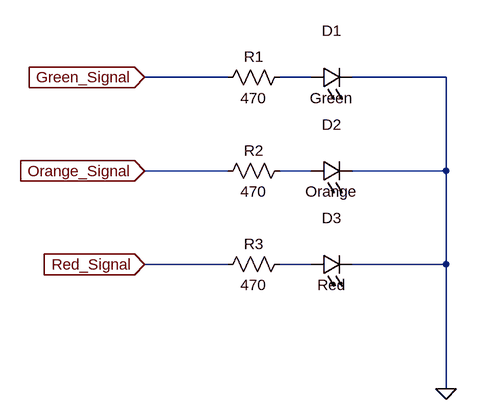
[diagram p0: schematic LEDDriverCircuit.asc]
LEDDriverCircuit.asc, the LTspice schematic file:
Version 4
SHEET 1 880 680
WIRE -16 96 -144 96
WIRE 112 96 64 96
WIRE 320 96 176 96
WIRE -16 240 -144 240
WIRE 112 240 64 240
WIRE 320 240 320 96
WIRE 320 240 176 240
WIRE -16 384 -144 384
WIRE 112 384 64 384
WIRE 320 384 320 240
WIRE 320 384 176 384
WIRE 320 576 320 384
FLAG 320 576 0
FLAG -144 96 Green_Signal
IOPIN -144 96 In
FLAG -144 240 Orange_Signal
IOPIN -144 240 In
FLAG -144 384 Red_Signal
IOPIN -144 384 In
SYMBOL LED 112 112 R270
WINDOW 0 72 32 VTop 2
WINDOW 3 0 32 VBottom 2
SYMATTR InstName D1
SYMATTR Value Green
SYMBOL LED 112 256 R270
WINDOW 0 72 32 VTop 2
WINDOW 3 0 32 VBottom 2
SYMATTR InstName D2
SYMATTR Value Orange
SYMBOL LED 112 400 R270
WINDOW 0 72 32 VTop 2
WINDOW 3 0 32 VBottom 2
SYMATTR InstName D3
SYMATTR Value Red
SYMBOL res 80 80 R90
WINDOW 0 0 56 VBottom 2
WINDOW 3 32 56 VTop 2
SYMATTR InstName R1
SYMATTR Value 470
SYMBOL res 80 224 R90
WINDOW 0 0 56 VBottom 2
WINDOW 3 32 56 VTop 2
SYMATTR InstName R2
SYMATTR Value 470
SYMBOL res 80 368 R90
WINDOW 0 0 56 VBottom 2
WINDOW 3 32 56 VTop 2
SYMATTR InstName R3
SYMATTR Value 470

The netlist it stands for:
* LEDDriverCircuit.asc
D1 N001 0 Green
D2 N002 0 Orange
D3 N003 0 Red
R1 N001 Green_Signal 470
R2 N002 Orange_Signal 470
R3 N003 Red_Signal 470
.model D D
.lib standard.dio
.backanno
.end